# EAGLE design Öffnungsmelder-102 (EAGLE 4.92)
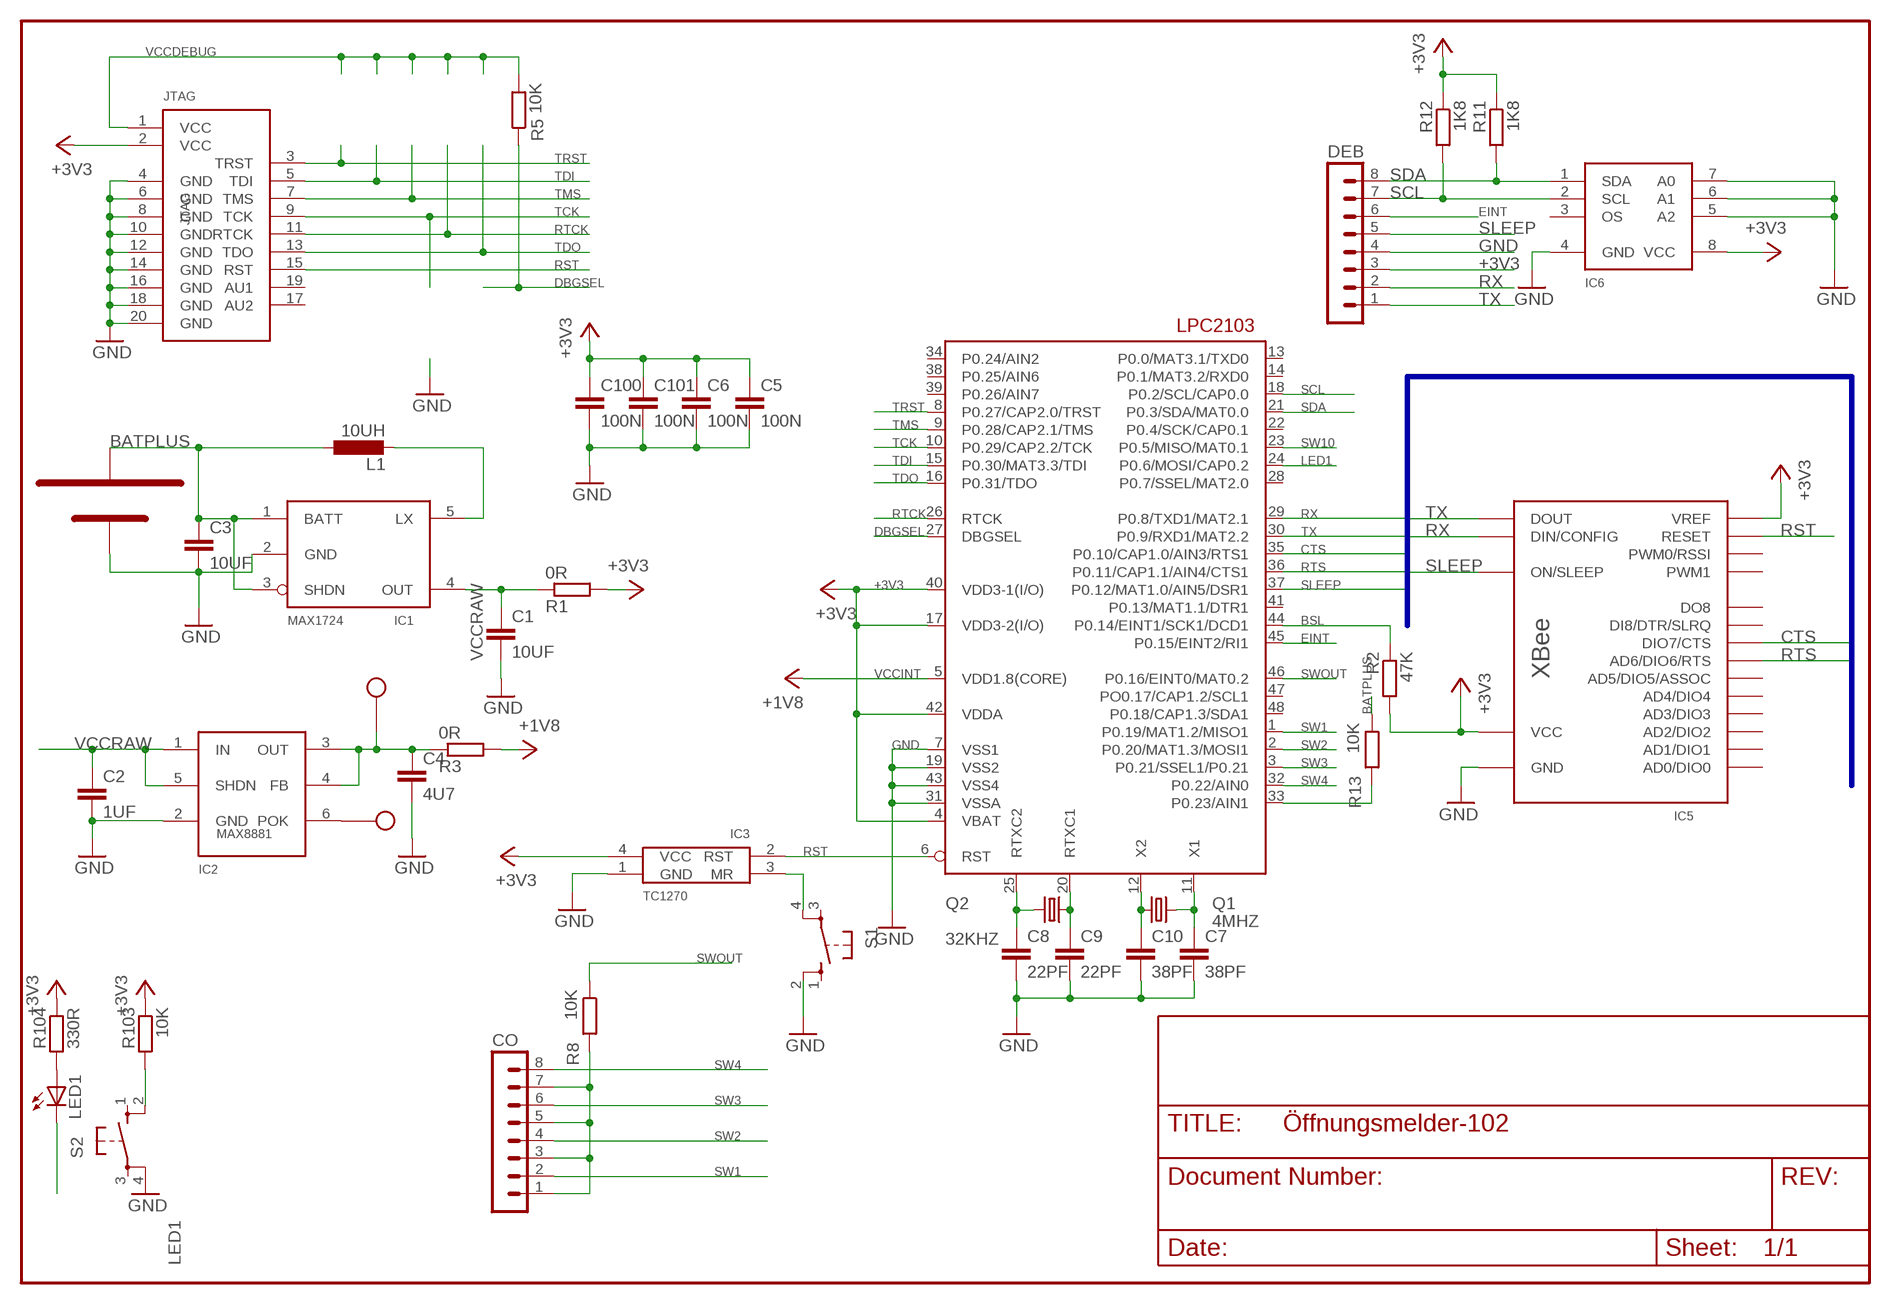
[diagram p0: schematic, sheet 1]

## Parts
$$GND10  STITCHVIA  [STITCHVIA]
$$GND11  STITCHVIA  [STITCHVIA]
BAT  BATTERY_SINGLECELL  [BATTERYHOLDER_AA_SINGLE]
C1  10UF  C-EUC0805  [C0805]
C2  1UF  C-EUC0805  [C0805]
C3  10UF  C-EUC0805  [C0805]
C4  4U7  C-EUC0805  [C0805]
C5  100N  C-EUC0805  [C0805]
C6  100N  C-EUC0805  [C0805]
C7  38PF  C-EUC0603  [C0603]
C8  22PF  C-EUC0805  [C0805]
C9  22PF  C-EUC0805  [C0805]
C10  38PF  C-EUC0603  [C0603]
C100  100N  C-EUC0805  [C0805]
C101  100N  C-EUC0805  [C0805]
CO  MA08-1  [MA08-1]
DEB  MA08-1  [MA08-1]
IC1  MAX1724  [SOT23-5L]
IC2  MAX8881  [SOT23-6L]
IC3  TC1270  [SOT143R_INFINEON]
IC4  LPC2103  [LQFP48]
IC5  XBEE  [XBEE]
IC6  SE95  [MSOP8]
JTAG  ARM-JTAGMEDIUM-T  [CON-10-2-2.0-THROUGH]
L1  10UH  L-EU  [L2634MURATA]
LED1  LEDCHIP-LED0805  [CHIP-LED0805]
Q1  4MHZ  CRYTALHC49S  [HC49/S]
Q2  32KHZ  CRYTALTC26V  [TC26V]
R1  0R  R-EU_M0805  [M0805]
R2  47K  R-EU_M0805  [M0805]
R3  0R  R-EU_M0805  [M0805]
R5  10K  R-EU_M0805  [M0805]
R8  10K  R-EU_M0805  [M0805]
R11  1K8  R-EU_M0805  [M0805]
R12  1K8  R-EU_M0805  [M0805]
R13  10K  R-EU_M0805  [M0805]
R103  10K  R-EU_M0805  [M0805]
R104  330R  R-EU_M0805  [M0805]
S1  10XX  [B3F-10XX]
S2  10XX  [B3F-10XX]

## Nets
+3V3: C5.1 C6.1 C100.1 C101.1 DEB.3 IC3.4(VCC) IC4.4(VBAT) IC4.17(VDD3-2(I/O)) IC4.40(VDD3-1(I/O)) IC4.42(VDDA) IC5.1(VCC) IC5.14(VREF) IC6.8(VCC) JTAG.2(VCC) R1.2 R2.2 R11.1 R12.1 R103.1 R104.1
BATMEASURE: IC4.33(P0.23/AIN1) R13.2
BATPLUS: BAT.VCC C3.1 IC1.1(BATT) IC1.3(SHDN) L1.P$1 R13.1
BSL: IC4.44(P0.14/EINT1/SCK1/DCD1) R2.1
CTS: IC4.35(P0.10/CAP1.0/AIN3/RTS1) IC5.12(DIO7/CTS)
DBGSEL: IC4.27(DBGSEL) R5.1
EINT: DEB.6 IC4.45(P0.15/EINT2/RI1)
GND: BAT.GND C1.2 C2.2 C3.2 C4.2 C5.2 C6.2 C7.2 C8.2 C9.2 C10.2 C100.2 C101.2 DEB.4 IC1.2(GND) IC2.2(GND) IC3.1(GND) IC4.7(VSS1) IC4.19(VSS2) IC4.31(VSSA) IC4.43(VSS4) IC5.10(GND) IC6.4(GND) IC6.5(A2) IC6.6(A1) IC6.7(A0) JTAG.4(GND) JTAG.6(GND) JTAG.8(GND) JTAG.10(GND) JTAG.12(GND) JTAG.14(GND) JTAG.16(GND) JTAG.18(GND) JTAG.20(GND) S1.2 S2.4
LED1: IC4.24(P0.6/MOSI/CAP0.2) LED1.C
LX: IC1.5(LX) L1.P$2
MANRST: IC3.3(MR) S1.4
N$2: $$GND11.1(GND) IC2.6(POK)
N$14: LED1.A R104.2
RST: IC3.2(RST) IC4.6(RST) IC5.5(RESET) JTAG.15(RST)
RTCK: IC4.26(RTCK) JTAG.11(RTCK)
RTS: IC4.36(P0.11/CAP1.1/AIN4/CTS1) IC5.16(AD6/DIO6/RTS)
RTXC1: C9.1 IC4.20(RTXC1) Q2.1
RTXC2: C8.1 IC4.25(RTXC2) Q2.2
RX: DEB.2 IC4.29(P0.8/TXD1/MAT2.1) IC5.3(DIN/CONFIG)
SCL: DEB.7 IC4.18(P0.2/SCL/CAP0.0) IC6.2(SCL) R12.2
SDA: DEB.8 IC4.21(P0.3/SDA/MAT0.0) IC6.1(SDA) R11.2
SLEEP: DEB.5 IC4.37(P0.12/MAT1.0/AIN5/DSR1) IC5.13(ON/SLEEP)
SW1: CO.2 IC4.1(P0.19/MAT1.2/MISO1)
SW2: CO.4 IC4.2(P0.20/MAT1.3/MOSI1)
SW3: CO.6 IC4.3(P0.21/SSEL1/P0.21)
SW4: CO.8 IC4.32(P0.22/AIN0)
SW10: IC4.23(P0.5/MISO/MAT0.1) R103.2 S2.2
SWOUT: IC4.46(P0.16/EINT0/MAT0.2) R8.1
SWOUT2: CO.1 CO.3 CO.5 CO.7 R8.2
TCK: IC4.10(P0.29/CAP2.2/TCK) JTAG.9(TCK)
TDI: IC4.15(P0.30/MAT3.3/TDI) JTAG.5(TDI)
TDO: IC4.16(P0.31/TDO) JTAG.13(TDO)
TMS: IC4.9(P0.28/CAP2.1/TMS) JTAG.7(TMS)
TRST: IC4.8(P0.27/CAP2.0/TRST) JTAG.3(TRST)
TX: DEB.1 IC4.30(P0.9/RXD1/MAT2.2) IC5.2(DOUT)
VCCDEBUG: JTAG.1(VCC) R5.2
VCCINT: IC4.5(VDD1.8(CORE)) R3.2 ; supply symbol labelled +1V8
VCCINTREG: $$GND10.1(GND) C4.1 IC2.3(OUT) IC2.4(FB) R3.1
VCCRAW: C1.1 C2.1 IC1.4(OUT) IC2.1(IN) IC2.5(SHDN) R1.1
X1: C7.1 IC4.11(X1) Q1.2
X2: C10.1 IC4.12(X2) Q1.1
Unconnected: IC4.13(P0.0/MAT3.1/TXD0) IC4.14(P0.1/MAT3.2/RXD0) IC4.22(P0.4/SCK/CAP0.1) IC4.28(P0.7/SSEL/MAT2.0) IC4.34(P0.24/AIN2) IC4.38(P0.25/AIN6) IC4.39(P0.26/AIN7) IC4.41(P0.13/MAT1.1/DTR1) IC4.47(PO0.17/CAP1.2/SCL1) IC4.48(P0.18/CAP1.3/SDA1) IC5.4(DO8) IC5.6(PWM0/RSSI) IC5.7(PWM1) IC5.9(DI8/DTR/SLRQ) IC5.11(AD4/DIO4) IC5.15(AD5/DIO5/ASSOC) IC5.17(AD3/DIO3) IC5.18(AD2/DIO2) IC5.19(AD1/DIO1) IC5.20(AD0/DIO0) IC6.3(OS) JTAG.17(AU2) JTAG.19(AU1) S1.1 S1.3 S2.1 S2.3

## Buses
SLEEP,RX,TX,CTS,RTS

## Library data of the parts
$$GND10 $$GND11 = turbod3:STITCHVIA
BAT = turbod3:BATTERY_SINGLECELL
C1-C10 C100 C101 = turbod3:C-EU: CAPACITOR, European symbol
CO DEB = con-lstb:MA08-1: PIN HEADER
IC1 = turbod3:MAX1724
IC2 = turbod3:MAX8881
IC3 = turbod3:TC1270
IC4 = turbod3:LPC2103: LPC2101/2102/2103 microcontroler from Philips
IC5 = turbod3:XBEE
IC6 = turbod3:SE95
JTAG = turbod3:ARM-JTAG
L1 = turbod3:L-EU: INDUCTOR, European symbol
LED1 = led:LED: LED OSRAM: - CHIPLED LG R971, LG N971, LY N971, LG Q971, LY Q971, LO R971, LY R971 LH N974, LH R974 LS Q976, LO Q976, LY Q976 LO Q996 - Hyper CHIPLED LW Q18S LB Q993, LB Q99A, LB R99A - SideLED LS A670, LO A670, LY A670, LG A670, LP A670 LB A673, LV A673, LT A673, LW A673 LH A674 LY A675 LS A676, LA A676, LO A676, LY A676, LW A676 LS A679, LY A679, LG A679 - Hyper Micro SIDELED® LS Y876, LA Y876, LO Y876, LY Y876 LT Y87S - SmartLED LW L88C, LW L88S LB L89C, LB L89S, LG L890 LS L89K, LO L89K, LY L89K LS L896, LA L896, LO L896, LY L896 - TOPLED LS T670, LO T670, LY T670, LG T670, LP T670 LSG T670, LSP T670, LSY T670, LOP T670, LYG T670 LG T671, LOG T671, LSG T671 LB T673, LV T673, LT T673, LW T673 LH T674 LS T676, LA T676, LO T676, LY T676, LB T676, LH T676, LSB T676, LW T676 LB T67C, LV T67C, LT T67C, LS T67K, LO T67K, LY T67K, LW E67C LS E67B, LA E67B, LO E67B, LY E67B, LB E67C, LV E67C, LT E67C LW T67C LS T679, LY T679, LG T679 LS T770, LO T770, LY T770, LG T770, LP T770 LB T773, LV T773, LT T773, LW T773 LH T774 LS E675, LA E675, LY E675, LS T675 LS T776, LA T776, LO T776, LY T776, LB T776 LHGB T686 LT T68C, LB T68C - Hyper Mini TOPLED® LB M676 - Mini TOPLED Santana® LG M470 LS M47K, LO M47K, LY M47K Source: http://www.osram.convergy.de - LUMILED® LXK2-PW12-R00, LXK2-PW12-S00, LXK2-PW14-U00, LXK2-PW14-V00 LXK2-PM12-R00, LXK2-PM12-S00, LXK2-PM14-U00 LXK2-PE12-Q00, LXK2-PE12-R00, LXK2-PE12-S00, LXK2-PE14-T00, LXK2-PE14-U00 LXK2-PB12-K00, LXK2-PB12-L00, LXK2-PB12-M00, LXK2-PB14-N00, LXK2-PB14-P00, LXK2-PB14-Q00 LXK2-PR12-L00, LXK2-PR12-M00, LXK2-PR14-Q00, LXK2-PR14-R00 LXK2-PD12-Q00, LXK2-PD12-R00, LXK2-PD12-S00 LXK2-PH12-R00, LXK2-PH12-S00 LXK2-PL12-P00, LXK2-PL12-Q00, LXK2-PL12-R00 Source: www.luxeon.com
Q1 Q2 = turbod3:CRYTAL: CRYSTAL
R1-R3 R5 R8 R11-R13 R103 R104 = turbod3:R-EU_: RESISTOR, European symbol
S1 S2 = KEY_B:10XX

## Board
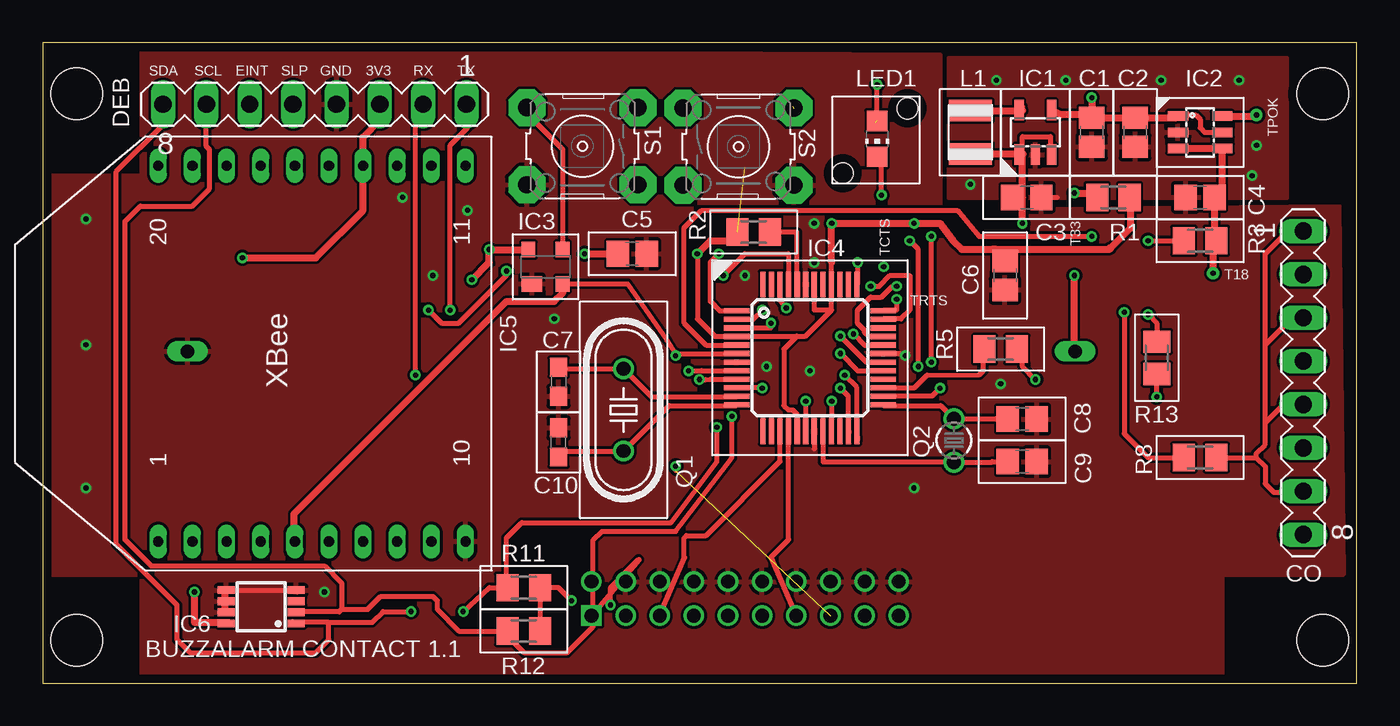
[diagram p1: board, top side]
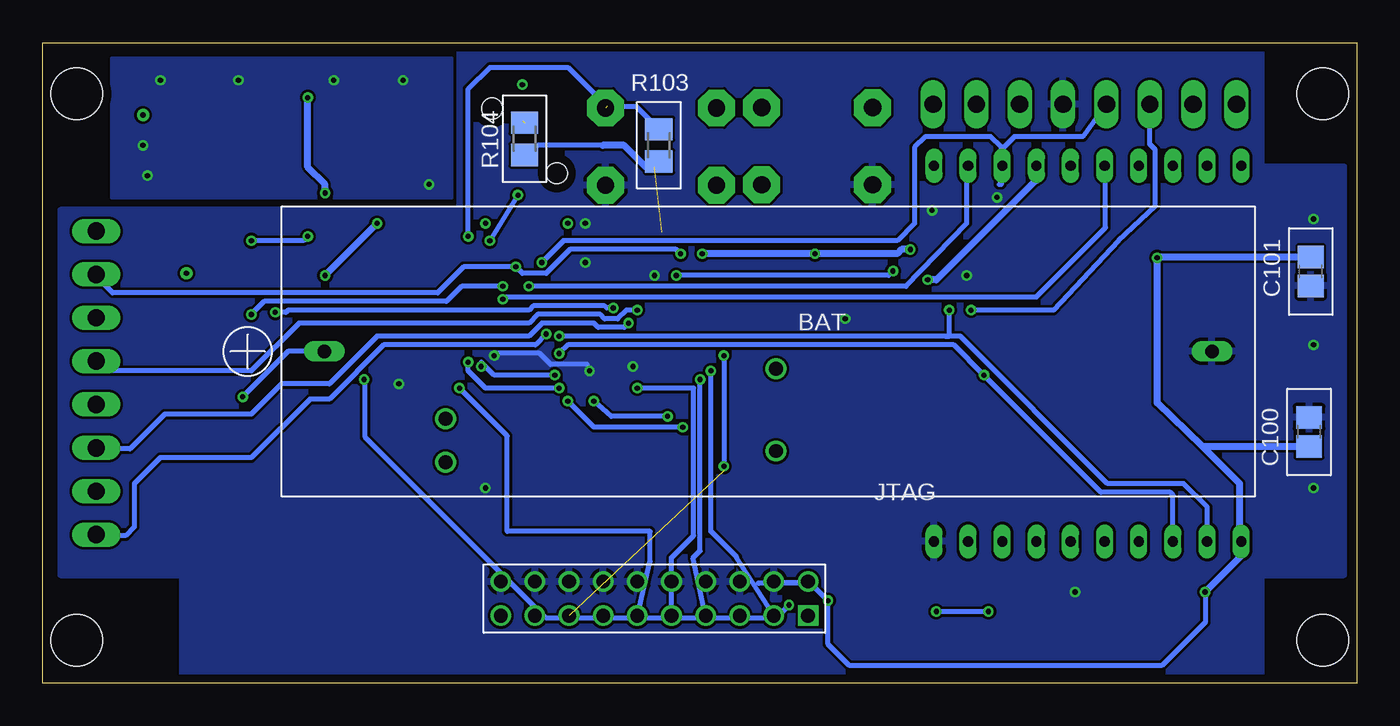
[diagram p2: board, bottom side, seen from below]

Size 77 x 37.51 mm. Coordinates in mm from the lower left corner, seen from the top.
Outline: 0,0 77,0 77,37.51 0,37.51 0,0
Copper layers (1*16): Top 0.035mm / dielectric 1.5mm / Bottom 0.035mm
Design rules "PCB-POOL": minimum track width 6mil, minimum drill 12mil, track to track 6mil, track to pad 6mil, pad to pad 6mil, via to via 6mil, smd to smd 6mil, copper to edge 20mil, drill to drill 8mil, minimum pad ring 8mil, minimum via ring 6mil, stop-mask expansion 3mil, vias tented up to drill 0mil, thermal gap 8mil
Holes 3 mm at 2,34.51 2,2.51 75,34.51 75,2.51

### Footprints (pad centres in the part's own frame; a part is rotated, then mirrored left to right if it is on the bottom)
STITCHVIA = drill 0.305 pad 0.61 round: 1 0,0
BATTERYHOLDER_AA_SINGLE = drill 0.8 pad 1 long: GND -26.5,0.5; VCC 25.5,0.5
C0805 = smd 1.3 x 1.5: 1 -0.85,0; 2 0.85,0
C0603 = smd 1.1 x 1: 1 -0.85,0; 2 0.85,0
MA08-1 = drill 1.016 long: 1 -8.89,0; 2 -6.35,0; 3 -3.81,0; 4 -1.27,0; 5 1.27,0; 6 3.81,0; 7 6.35,0; 8 8.89,0
SOT23-5L = smd 0.55 x 1.2: 1 -0.95,-1.3; 2 0,-1.3; 3 0.95,-1.3; 4 0.95,1.3; 5 -0.95,1.3
SOT23-6L = smd 0.55 x 1.2: 1 -0.95,-1.3; 2 0,-1.3; 3 0.95,-1.3; 4 0.95,1.3; 5 0,1.3; 6 -0.95,1.3
SOT143R_INFINEON = smd 1.2 x 0.9: 1 -0.8,-1 | smd 0.8 x 0.9: 2 1,-1; 3 1,1; 4 -1,1
LQFP48 = smd 1.5 x 0.3: 1 -4.3,2.75; 2 -4.3,2.25; 3 -4.3,1.75; 4 -4.3,1.25; 5 -4.3,0.75; 6 -4.3,0.25; 7 -4.3,-0.25; 8 -4.3,-0.75; 9 -4.3,-1.25; 10 -4.3,-1.75; 11 -4.3,-2.25; 12 -4.3,-2.75; 25 4.3,-2.75; 26 4.3,-2.25; 27 4.3,-1.75; 28 4.3,-1.25; 29 4.3,-0.75; 30 4.3,-0.25; 31 4.3,0.25; 32 4.3,0.75; 33 4.3,1.25; 34 4.3,1.75; 35 4.3,2.25; 36 4.3,2.75 | smd 0.3 x 1.5: 13 -2.75,-4.3; 14 -2.25,-4.3; 15 -1.75,-4.3; 16 -1.25,-4.3; 17 -0.75,-4.3; 18 -0.25,-4.3; 19 0.25,-4.3; 20 0.75,-4.3; 21 1.25,-4.3; 22 1.75,-4.3; 23 2.25,-4.3; 24 2.75,-4.3; 37 2.75,4.3; 38 2.25,4.3; 39 1.75,4.3; 40 1.25,4.3; 41 0.75,4.3; 42 0.25,4.3; 43 -0.25,4.3; 44 -0.75,4.3; 45 -1.25,4.3; 46 -1.75,4.3; 47 -2.25,4.3; 48 -2.75,4.3
XBEE = drill 0.6 long: 1 -11,17; 2 -11,15; 3 -11,13; 4 -11,11; 5 -11,9; 6 -11,7; 7 -11,5; 8 -11,3; 9 -11,1; 10 -11,-1; 11 11,-1; 12 11,1; 13 11,3; 14 11,5; 15 11,7; 16 11,9; 17 11,11; 18 11,13; 19 11,15; 20 11,17
MSOP8 = smd 0.45 x 1: 1 -0.975,-2.05; 2 -0.325,-2.05; 3 0.325,-2.05; 4 0.975,-2.05; 5 0.975,2.05; 6 0.325,2.05; 7 -0.325,2.05; 8 -0.975,2.05
CON-10-2-2.0-THROUGH = drill 0.8 square: 1 -8,2 | drill 0.8 round: 2 -8,0; 3 -6,2; 4 -6,0; 5 -4,2; 6 -4,0; 7 -2,2; 8 -2,0; 9 0,2; 10 0,0; 11 2,2; 12 2,0; 13 4,2; 14 4,0; 15 6,2; 16 6,0; 17 8,2; 18 8,0; 19 10,2; 20 10,0
L2634MURATA = smd 1.27 x 2.54: P$1 -1.27,0; P$2 1.27,0
CHIP-LED0805 = smd 1.2 x 1.2: A 0,-1.05; C 0,1.05
HC49/S = drill 0.813 round: 1 -2.413,0; 2 2.413,0
TC26V = drill 0.813 round: 1 -1.27,0; 2 1.27,0
M0805 = smd 1.3 x 1.6: 1 -0.95,0; 2 0.95,0
B3F-10XX = drill 1.016 pad 2.159 octagon: 1 -3.379,2.312; 2 3.123,2.312; 3 -3.379,-2.209; 4 3.123,-2.209
LIGHTPIPE1 = hole 1.2: -2.4,2.4; 1.4,-1.4

### Placement (x,y rotation side)
$$GND10  68.58,24 0 top
$$GND11  71.12,33.27 0 top
BAT  34.99,19.92 180 bottom
C1  61.47,32.26 270 top
C2  64.01,32.26 270 top
C3  57.66,28.45 0 top
C4  67.82,28.45 180 top
C5  34.54,25.15 0 top
C6  56.39,23.88 270 top
C7  30.23,17.65 270 top
C8  57.39,15.47 0 top
C9  57.39,12.97 0 top
C10  30.23,14.1 90 top
C100  2.8,14.71 90 bottom
C101  2.7,24.11 270 bottom
CO  73.86,17.59 270 top
DEB  15.94,33.9 180 top
IC1  58.17,32.26 0 top
IC2  67.82,32.26 270 top
IC3  29.46,24.38 0 top
IC4  44.96,19.05 0 top
IC5  23.77,19.29 90 top
IC6  12.8,4.47 90 top
JTAG  40.16,5.95 180 bottom
L1  54.36,32.26 90 top
LED1  48.9,31.88 180 top
Q1  34.04,16 90 top
Q2  53.39,14.21 90 top
R1  62.74,28.45 0 top
R2  41.66,26.42 180 top
R3  67.82,25.91 180 top
R5  56.13,19.56 0 top
R8  67.82,13.21 0 top
R11  28.19,5.59 180 top
R12  28.19,3.05 180 top
R13  65.28,19.05 90 top
R103  40.89,31.5 90 bottom
R104  48.77,31.88 90 bottom
S1  31.5,31.5 180 top
S2  40.89,31.37 0 top
U$6  [LIGHTPIPE1]  49.28,32.26 90 top

### Tracks (layer width: path | path; a pad name or v marks a point on that pad's centre or on a via)
+3V3  (via drill 0.3)  (1 unrouted)
  Top 0.305: 46.23,21.84 44.7,20.32 44.2,20.32 | IC4.42 45.21,23.37 | IC4.42 | IC4.42 | IC4.42 45.21,21.84 46.23,21.84 | IC4.40 46.23,23.37 | 46.23,21.84 46.23,23.37 | 44.2,20.32 40.68,20.32 IC4.4 39.39,20.3 38.35,21.34 v38.35,25.15 | 44.2,14.76 IC4.17 44.2,14.74 | 44.2,14.74 44.2,14.73 | 44.2,14.74 44.2,15.75 43.94,16 43.69,16 43.43,16.26 43.43,19.56 44.2,20.32 | 46.23,23.37 46.23,24.64 | R12.1 29.21,3.3 29.14,3.37 R11.1 30.23,5.59 v30.99,4.83 | 62.48,25.53 62.55,25.46 62.61,25.4 | 26.18,25.38 26.18,25.16 v26.16,25.4
  Top 0.406: 46.23,24.64 v46.23,26.92 v51.05,26.92 52.58,26.92 53.34,25.91 53.85,25.4 55.88,25.4 | v31.75,25.15 C5.1 | DEB.3 19.75,33.08 19.81,33.02 18.77,31.98 18.77,29.44 | 18.77,29.44 IC5.14 | 18.77,29.44 18.77,27.66 16,24.91 v11.7,24.91 | v8.89,5.33 8.89,3.56 10.92,3.56 10.86,3.5 IC6.8 | v38.35,25.15 39.12,25.91 40.64,25.91 40.71,25.97 R2.2 | 55.88,25.4 62.48,25.4 62.55,25.46 63.75,26.67 63.75,28.45 R1.2 | 55.88,25.4 55.63,25.4 | 26.18,25.38 IC3.4 | v26.16,25.4 26.16,24.64 v25.15,23.62 | C6.1 56.39,24.89 55.88,25.4
  Bottom 0.305: v8.89,5.33 8.89,3.56 11.43,1.02 29.72,1.02 30.99,2.29 v30.99,4.83 32,5.84 35.05,5.84 35.08,5.87 JTAG.2 | R104.1 48.77,30.73 48.01,31.5 44.2,31.5
  Bottom 0.406: 44.2,31.5 42.93,31.5 41.66,30.23 41.15,30.23 40.89,30.48 R103.1 | v26.16,25.4 26.67,25.4 26.92,25.15 v31.75,25.15 v38.35,25.15 | IC5.14 18.77,29.44 18.8,29.46 24.64,23.62 v25.15,23.62 | v8.89,5.33 6.77,7.45 IC5.1 6.86,8.38 6.86,11.68 9.06,13.88 | 9.06,13.88 C100.1 | 9.06,13.88 11.7,16.41 v11.7,24.91 11.7,24.96 C101.1
BATMEASURE  (via drill 0.3)
  Top 0.305: v50.04,23.24 49.78,23.24 49.15,22.61 48.51,22.61 47.75,21.84 47.75,21.08 48.13,20.7 48.13,20.57 48.41,20.3 IC4.33 | v64.77,21.59 65.28,21.08 R13.2
  Bottom 0.305: v64.77,21.59 64.01,22.35 53.34,22.35 52.45,23.24 v50.04,23.24
BATPLUS  (via drill 0.3, 0.3 pad 0.61)
  Top 0.305: 57.44,30.99 IC1.1 57.4,30.89 | 57.4,30.96 57.4,32 59.05,32 59.05,30.96 | 59.05,30.96 59.05,30.73 | 59.05,30.96 IC1.3 | v65.28,16.76 R13.1
  Top 0.406: 57.44,30.99 L1.P$1 | 57.4,28.45 57.4,30.89 | 57.4,28.45 C3.1 | v57.4,26.92 57.4,28.45 | IC1.1 57.4,30.96 | BAT.VCC 60.49,19.52 60.45,19.56 v60.45,23.88
  Bottom 0.305: BAT.VCC 62.62,19.42 v65.28,16.76
  Bottom 0.406: v60.45,23.88 v57.4,26.92
BSL
  Top 0.305: IC4.44 44.2,23.36 44.2,26.42 R2.1
CTS  (via drill 0.3)
  Top 0.305: IC4.35 49.28,21.32 49.28,21.34 50.29,21.34 50.8,21.84 50.8,23.88 49.66,23.88 49.02,23.24 v48.51,23.24
  Bottom 0.305: IC5.12 22.86,29.32 22.86,26.92 26.42,23.24 v48.51,23.24
DBGSEL
  Top 0.305: IC4.27 51.08,17.3 51.82,18.03 54.89,18.06 55.12,18.29 55.12,19.81 R5.1
EINT  (via drill 0.3)
  Top 0.305: IC4.45 43.71,24.36 43.69,25.15 41.15,25.15 v39.88,23.88 | 12.19,33.78 12.13,33.84 DEB.6 | v27.18,24.13 27.18,23.88 24.38,21.08 23.37,21.08 v22.61,21.84
  Bottom 0.305: v39.88,23.88 27.43,23.88 v27.18,24.13 | DEB.6 12.13,31.56 11.81,31.24 11.81,27.94 13.97,25.91 17.78,21.84 v22.61,21.84
GND  (via drill 0.3)
  Top 0.305: C3.2 59.44,28.45 | IC6.5 14.94,5.45 | C1.2 61.47,31.5 60.86,30.89 | IC4.19 45.21,13.72 | IC4.31 50.67,19.3 v50.55,19.18
  Top 0.406: 14.94,5.38 14.88,5.45 IC6.4 14.94,5.45 | 10.67,4.79 10.67,4.78 | IC6.5 10.67,5.45 10.67,4.79 | IC6.7 10.67,4.14 10.67,4.79 | 10.67,4.79 IC6.6
  Bottom 0.305: v50.55,19.18 50.42,19.18 50.29,19.3 47.88,19.3 47.24,18.67 45.09,18.67
  other vias: 54.36,29.21 55.88,35.31 59.94,35.31 65.53,35.31 70.1,35.31 71.12,31.5 70.87,29.72 44.96,18.29 16.51,5.33 42.42,18.54 45.21,26.92 41.15,23.88 45.21,24.64 22.86,23.88 24.89,27.69 29.97,21.34 21.08,28.45 2.54,27.18 2.54,19.81 2.54,11.43 51.05,11.43 56.13,17.53
  pour Top: 0.51,29.72 5.84,29.72 5.84,37.05 52.58,36.8 52.58,27.69 75.95,27.94 76.2,6.35 69.09,6.35 69.09,0.51 5.84,0.51 5.84,6.35 0.51,6.35
  pour Bottom: 0.76,6.35 0.76,30.23 5.59,30.23 5.59,37.05 52.58,37.05 52.58,27.69 75.95,27.69 75.95,6.35 68.83,6.35 68.83,0.51 5.59,0.51 5.59,6.35
  pour Top: 53.09,36.58 53.09,28.45 72.9,28.45 72.9,36.58
  pour Bottom: 53.09,36.58 53.09,28.45 72.9,28.45 72.9,36.58
LED1  (via drill 0.3, 0.3 pad 0.61)
  Top 0.305: 47.73,14.22 IC4.24 47.71,17.32 v46.99,18.03 | v49.15,28.57 49.15,30.73 48.77,30.73 48.86,30.83 LED1.C | v50.8,25.91 51.31,25.4 v51.31,18.54
  Bottom 0.305: v50.8,25.91 v49.15,28.57 | v46.99,18.03 50.55,18.03 51.31,18.8 v51.31,18.54
LX
  Top 0.305: 57.4,33.62 IC1.5 | 57.4,33.62 57.4,33.78 | 57.4,33.53 57.4,33.62
  Top 0.406: L1.P$2 57.4,33.53
MANRST
  Top 0.305: IC3.3 30.48,25.4 30.48,31.24 28.45,33.27 28.45,33.78 | 28.45,33.78 | 28.45,33.78 S1.4
N$2
  Top 0.406: 71.12,33.21 $$GND11.1 | IC2.6 71.12,33.21 | 71.12,33.21 71.12,33.15
N$14  (via drill 0.3)  (1 unrouted)
  Top 0.305: LED1.A v48.9,35.05
RST  (via drill 0.3)  (1 unrouted)
  Top 0.305: 37.08,19.3 IC4.6 | 37.08,19.3 v37.08,19.18 | 37.08,19.3 36.58,20.07 34.27,23.38 IC3.2 | v37.08,12.7 37.08,12.45
  Top 0.406: IC3.2 30.46,22.84 29.97,22.35 27.18,22.35 14.73,9.91 14.73,8.38 14.77,8.34 IC5.5
  Bottom 0.305: v37.08,19.18 v37.08,12.7
RTCK  (via drill 0.3)
  Top 0.305: IC4.26 52.11,16.8 v52.58,17.27
  Bottom 0.305: v52.58,17.27 49.78,14.48 49.78,8.89 41.4,8.89 41.4,7.11 41.43,7.14 JTAG.11
RTS  (via drill 0.3)
  Top 0.305: IC4.36 49.3,21.84 50.04,21.84 v50.04,22.48
  Bottom 0.305: IC5.16 14.73,29.36 14.73,26.67 18.8,22.61 49.91,22.61 v50.04,22.48
RTXC1
  Top 0.305: IC4.20 45.72,12.95 52.9,12.95 Q2.1 55.61,12.94 55.65,12.97 C9.1
RTXC2
  Top 0.305: IC4.25 49.28,16.28 49.28,16.26 52.62,16.26 Q2.2 55.87,15.48 | 55.87,15.48 55.85,15.47 C8.1 | 55.87,15.48 55.88,15.49
RX  (via drill 0.3)
  Top 0.305: 22.29,33.21 22.35,33.27 | 22.29,33.21 DEB.2 | v21.84,18.03 21.84,32.77 22.29,33.21 | IC4.29 49.28,18.29 | IC4.29 | v46.74,19.3 47.75,18.29 IC4.29
  Bottom 0.305: IC5.3 10.77,11.03 10.92,11.18 14.99,11.18 v21.84,18.03 23.62,19.81 46.23,19.81 v46.74,19.3
SCL  (via drill 0.3)
  Top 0.305: R12.2 24.38,3.05 23.11,4.32 23.11,4.83 22.86,5.08 19.81,5.08 19.05,4.32 17.53,4.32 | 17.53,4.32 17.37,4.17 14.83,4.17 | 27.24,2.73 28.19,1.78 30.73,1.78 32.26,3.3 32.26,8.38 32.77,8.89 37.08,8.89 40.39,13.21 v40.39,15.62 | 17.53,4.32 17.53,5.84 16.51,6.86 6.35,6.86 4.83,8.38 4.83,27.05 5.71,27.94 8.76,27.94 9.78,28.96 9.78,31.24 9.59,31.43 DEB.7 | IC4.18 v44.71,16.51 v44.7,16.51
  Top 0.406: 14.87,4.17 IC6.2 14.83,4.17 14.63,4.17 | R12.2 27.24,2.73
  Bottom 0.305: v40.39,15.62 43.69,15.62 v44.7,16.51
SDA  (via drill 0.3)
  Top 0.305: v21.59,4.19 19.94,4.19 19.3,3.56 16.76,3.56 | v24.64,4.19 26.16,5.59 R11.2 | 16.76,3.56 14.63,3.56 | v39.5,14.99 39.5,12.95 36.83,9.4 28.07,9.4 27.18,8.51 27.18,5.71 27.24,5.65 R11.2 | IC4.21 46.21,16.49 | 26.92,5.84 27.18,5.59 R11.2 | DEB.8 7.05,32.7 4.32,29.97 4.32,8.13 7.87,4.57 7.87,2.54 8.64,1.78 16,1.78 16.76,2.54 16.76,3.56
  Top 0.406: R11.2 27.43,5.59 | 14.63,3.56 14.69,3.5 IC6.1 | v46.23,16.51 46.21,16.49
  Bottom 0.305: v21.59,4.19 v24.64,4.19 | v39.5,14.99 44.7,14.99 v46.23,16.51
SLEEP  (via drill 0.3)
  Top 0.305: IC4.37 47.75,23.39 v47.75,24.64
  Bottom 0.305: DEB.5 16.06,32 20.07,32 20.83,31.24 | 20.83,29.21 20.97,29.21 | v47.75,24.64 46.48,25.91 26.92,25.91 25.91,26.92 25.91,31.37 25.27,32 21.46,32 20.83,31.37 20.83,31.24 | 20.83,29.21 20.83,29.35 IC5.13 20.77,30.02 20.83,29.97 | 20.83,29.97 20.83,29.21 | 20.83,31.24 20.83,29.97
SW1  (via drill 0.3 pad 0.61)
  Top 0.305: CO.2 | IC4.1 39.67,21.8 39.12,22.35 39.12,24.64 v39.62,25.15
  Bottom 0.305: v39.62,25.15 39.88,25.4 46.1,25.4 47.5,24 48.9,24 v49.28,24.38 52.32,24.38 53.85,22.86 72.9,22.86 73.91,23.88 CO.2
SW2  (via drill 0.3 pad 0.61)
  Top 0.305: CO.4 | IC4.2 41.62,21.3 v42.16,21.84
  Bottom 0.305: v42.16,21.84 42.8,21.84 43.31,21.34 44.07,21.34 44.32,21.59 48.01,21.59 48.51,21.08 61.98,21.08 64.77,18.29 73.41,18.29 73.91,18.8 CO.4
SW3  (via drill 0.3 pad 0.61)
  Top 0.305: 73.91,13.97 73.86,13.91 CO.6 73.91,13.72 | IC4.3 42.64,20.8 v42.67,21.08
  Bottom 0.305: v42.67,21.08 42.93,20.83 44.45,20.83 44.7,21.08 47.75,21.08 48.51,20.32 57.4,20.32 60.2,17.53 62.99,17.53 64.77,15.75 69.85,15.75 71.88,13.72 73.91,13.72 CO.6
SW4  (via drill 0.3 pad 0.61)
  Top 0.305: IC4.32 48.15,19.8 v47.5,20.45
  Bottom 0.305: v47.5,20.45 48.13,19.81 57.02,19.81 60.2,16.64 61.34,16.64 64.77,13.21 70.1,13.21 71.63,11.68 71.63,9.14 72.14,8.64 73.91,8.64 CO.8
SW10  (via drill 0.3, 0.3 pad 0.61)  (1 unrouted)
  Top 0.305: 47.24,14.71 IC4.23 47.21,16.8 v46.74,17.27 | v52.07,18.8 v52.07,26.16
  Bottom 0.305: R103.2 42.23,33.78 43.94,33.78 46.23,36.07 50.8,36.07 52.07,34.8 v52.07,26.16 | v46.74,17.27 51.05,17.27 52.07,18.29 v52.07,18.8
SWOUT  (via drill 0.3 pad 0.61)
  Top 0.305: IC4.46 43.21,22.38 v43.56,21.97 | 66.8,13.46 67.06,13.21 R8.1 64.77,13.21 63.37,14.61 v63.37,21.72
  Bottom 0.305: v43.56,21.97 43.94,21.97 44.07,22.1 48.26,22.1 48.51,21.84 62.61,21.84 62.74,21.72 v63.37,21.72
SWOUT2
  Top 0.305: R8.2 71.12,13.21 | 71.12,13.21 71.63,12.7 71.63,11.68 72.14,11.18 73.91,11.18 CO.7 | 71.12,13.21 71.12,13.46 71.63,13.97 71.63,15.24 | 71.63,15.24 72.64,16.26 73.91,16.26 CO.5 | CO.3 73.21,21.4 71.63,19.81 | 71.63,15.24 71.63,19.81 | CO.1 72.96,26.48 71.63,25.15 71.63,19.81
TCK  (via drill 0.3)
  Top 0.305: IC4.10 42.14,17.3 v42.16,17.27
  Bottom 0.305: v42.16,17.27 38.86,17.27 38.86,8.64 40.16,7.34 JTAG.9
TDI
  Top 0.305: IC4.15 43.21,12.98 38.86,8.64 37.72,8.64 37.59,8.51 37.59,7.37 37.62,7.34 JTAG.5
TDO
  Top 0.305: IC4.16 43.69,14.73 | IC4.16 | JTAG.13 42.7,7.34 42.67,7.37 43.71,8.4 IC4.16
TMS  (via drill 0.3)
  Top 0.305: v38.48,17.78 38.86,17.78 39.14,17.8 IC4.9
  Bottom 0.305: JTAG.7 38.89,7.34 38.48,7.75 v38.48,17.78
TRST  (via drill 0.3)
  Top 0.305: IC4.8 38.62,18.3 v37.85,18.29
  Bottom 0.305: JTAG.3 36.35,7.34 36.32,7.37 37.85,8.89 v37.85,18.29
TX  (via drill 0.3)
  Top 0.305: v23.88,21.84 23.88,31.5 24.89,32.51 24.89,33.08 DEB.1 | 49.28,18.8 49.53,18.8 | 49.28,18.8 IC4.30 | v46.74,20.32 48.26,18.8 49.28,18.8
  Bottom 0.305: IC5.2 8.77,10.3 10.16,11.68 14.61,11.68 23.24,20.32 24.13,20.32 | 24.89,33.27 24.83,33.21 DEB.1 | v23.88,21.84 23.88,20.32 24.13,20.32 | 24.13,20.32 v46.74,20.32
VCCDEBUG  (via drill 0.3)
  Top 0.305: v58.17,17.78 57.4,18.54 57.4,19.56 57.15,19.81 R5.2 | JTAG.1 34.95,7.22 34.92,7.24 33.27,5.59 v33.27,4.57
  Bottom 0.305: v58.17,17.78 58.1,17.71 58.1,14.41 47.5,3.81 34.04,3.81 v33.27,4.57
VCCINT  (via drill 0.3 pad 0.61)
  Top 0.305: IC4.5 38.87,19.8 37.59,21.08 37.59,26.67 38.61,27.69 53.59,27.69 54.86,26.16 v61.47,26.16 | 67.06,25.91 R3.2 v64.77,25.91
  Bottom 0.305: v64.77,25.91 61.72,25.91 v61.47,26.16
VCCINTREG
  Top 0.406: IC2.3 69.02,31.31 69.09,31.24 69.12,31.27 IC2.4 69.12,28.73 68.83,28.45 C4.1 68.67,26 68.58,25.91 | 68.58,25.91 R3.1 | $$GND10.1 68.58,25.91
VCCRAW  (via drill 0.3)
  Top 0.305: 66.55,33.27 67.56,33.27 67.82,33.02 67.82,32.51 68.07,32.26 IC2.5
  Top 0.406: IC1.4 59.65,33.27 61.47,33.27 | 61.47,33.27 C1.1 63.92,33.11 64.01,33.02 C2.1 66.38,33.11 66.55,33.27 66.52,33.24 IC2.1 | v61.47,34.29 61.47,33.27 | R1.1 61.79,28.51 61.59,28.7 v60.45,28.7
  Bottom 0.406: v60.45,28.7 60.45,29.21 61.47,30.23 v61.47,34.29
X1
  Top 0.305: IC4.11 40.64,16.78 40.64,16.76 35.69,16.76 Q1.2 30.1,18.41 30.19,18.5 C7.1
X2
  Top 0.305: IC4.12 40.64,16.28 40.64,16.26 36.7,16.26 Q1.1 30.48,13.59 30.23,13.34 C10.1

### Text on the board
tNames: SDA | SCL | EINT | SLP | GND | 3V3 | RX | TX | TPOK | T33 | TCTS | T18 | TRTS | BUZZALARM CONTACT 1.1